# Altium schematic sheet OSCILLAR_HFB_V1p0_HFLNAMP.SchDoc
size A4; SheetNumber: 5; SheetTotal: 11; Title_: High Freq. Low Noise Amp.
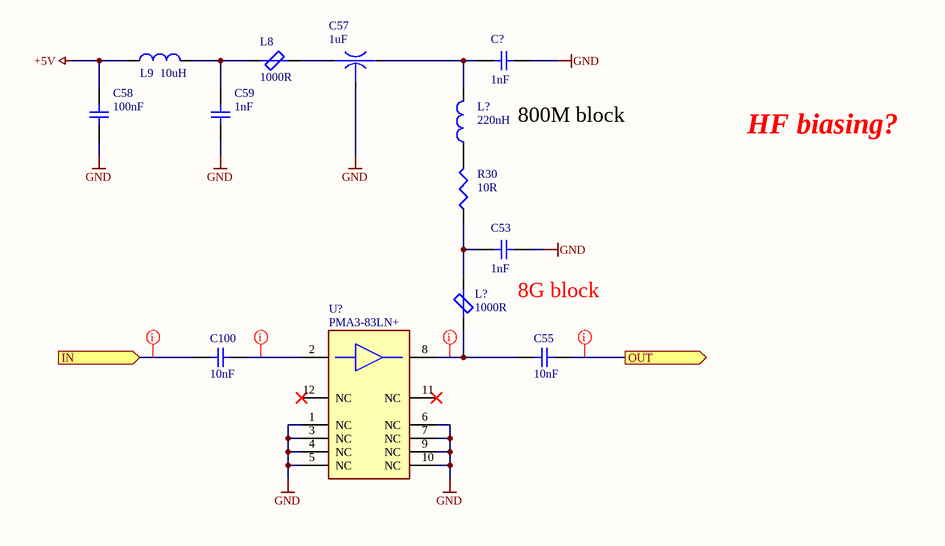
[diagram p0: OSCILLAR_HFB_V1p0_HFLNAMP.SchDoc]

## Parts
(Parts that share a designator on the sheet are numbered #1, #2 ... from top to bottom, then left to right.)
C53  1nF  [CAP-0805]
C55  10nF  [CAP_0603]
C57  1uF  [CAP-0805-EMI]
C58  100nF  [CAP-0805]
C59  1nF  [CAP-0805]
C100  10nF  [CAP_0603]
C?  1nF  [CAP-0805]
L8  1000R  [IND-0805-EMI]
L9  10uH  [IND-0805-EMI]
L?#1  220nH  [IND-0805]
L?#2  1000R  [IND-0805-EMI]
R30  10R  [RES-0805]
U?  PMA3-83LN+  [DQ1225]

## Ports
IN (in, see OSCILLAR_HFB_V1p0_MAIN), OUT (out, see OSCILLAR_HFB_V1p0_MAIN)

## Nets
+5V: C58.1 L9.1
GND: C53.2 C57.2 C58.2 C59.2 C?.2 U?.1(NC) U?.3(NC) U?.4(NC) U?.5(NC) U?.6(NC) U?.7(NC) U?.9(NC) U?.10(NC)
IN: C100.2 ; port IN
OUT: C55.1 ; port OUT
NetC53_1: C53.1 L?#2.2 R30.1
NetC55_2: C55.2 L?#2.1 U?.8(RF_OUT)
NetC57_1: C57.1 C?.1 L?#1.2
NetC57_3: C57.3 L8.2
NetC59_1: C59.1 L8.1 L9.2
NetC100_1: C100.1 U?.2(RF_IN)
NetL?#1_1: L?#1.1 R30.2

Not connected (* = marked no-connect by the designer): U? 11(NC)* 12(NC)*

## Layout directives
net class 50R: IN, NetC55_2, NetC100_1, OUT

## Notes on the sheet
- 800M block
- HF biasing?
- (near C53) 8G block
- Board:
- Author:
- Title:
- Project:
- SVN:
- Version:
- Sheet:
- of
- Contact:
- Modified:
- Size:
- A4

## Library data of the parts
C53 C55 C58 C59 C100 C? = NP-CAPACITOR: MLCC capacitor; Type: CAP
C57 = EMI_CAPACITOR: EMI filter capacitor; Type: CAP
L8 L?#2 = BLM21SP102SN1D: Chip Ferrite Bead, 1000R @100MHz, 1.6A; Part number: 81-BLM21SP102SN1D; Type: IND; Supplier: Mouser; ComponentLink1Description: Datasheet; ComponentLink1URL: ENFA0005-1915781.pdf; ComponentLink2Description: Order; ComponentLink2URL: https://hu.mouser.com/ProductDetail/Murata-Electronics/BLM21SP102SN1D?qs=17u8i%2FzlE88oj6hmj%252BXptA%3D%3D
L9 L?#1 = AC-INDUCTOR: Air core coil; Type: IND
R30 = RESISTOR: Metal Film Resistor; Type: RES
U? = PMA3-83LN+: RF Amplifier, Low noise, 500M-8GHz, +5V, +21dB; Part number: 139-PMA3-83LN; ComponentLink1Description: Datasheet; Supplier: Mouser; ComponentLink2Description: Order; ComponentLink2URL: https://hu.mouser.com/ProductDetail/Mini-Circuits/PMA3-83LN%2b?qs=xZ%2FP%252Ba9zWqbScBj7fhbP6Q%3D%3D; Type: IC